# EAGLE design esp32programer (EAGLE 9.6.2)
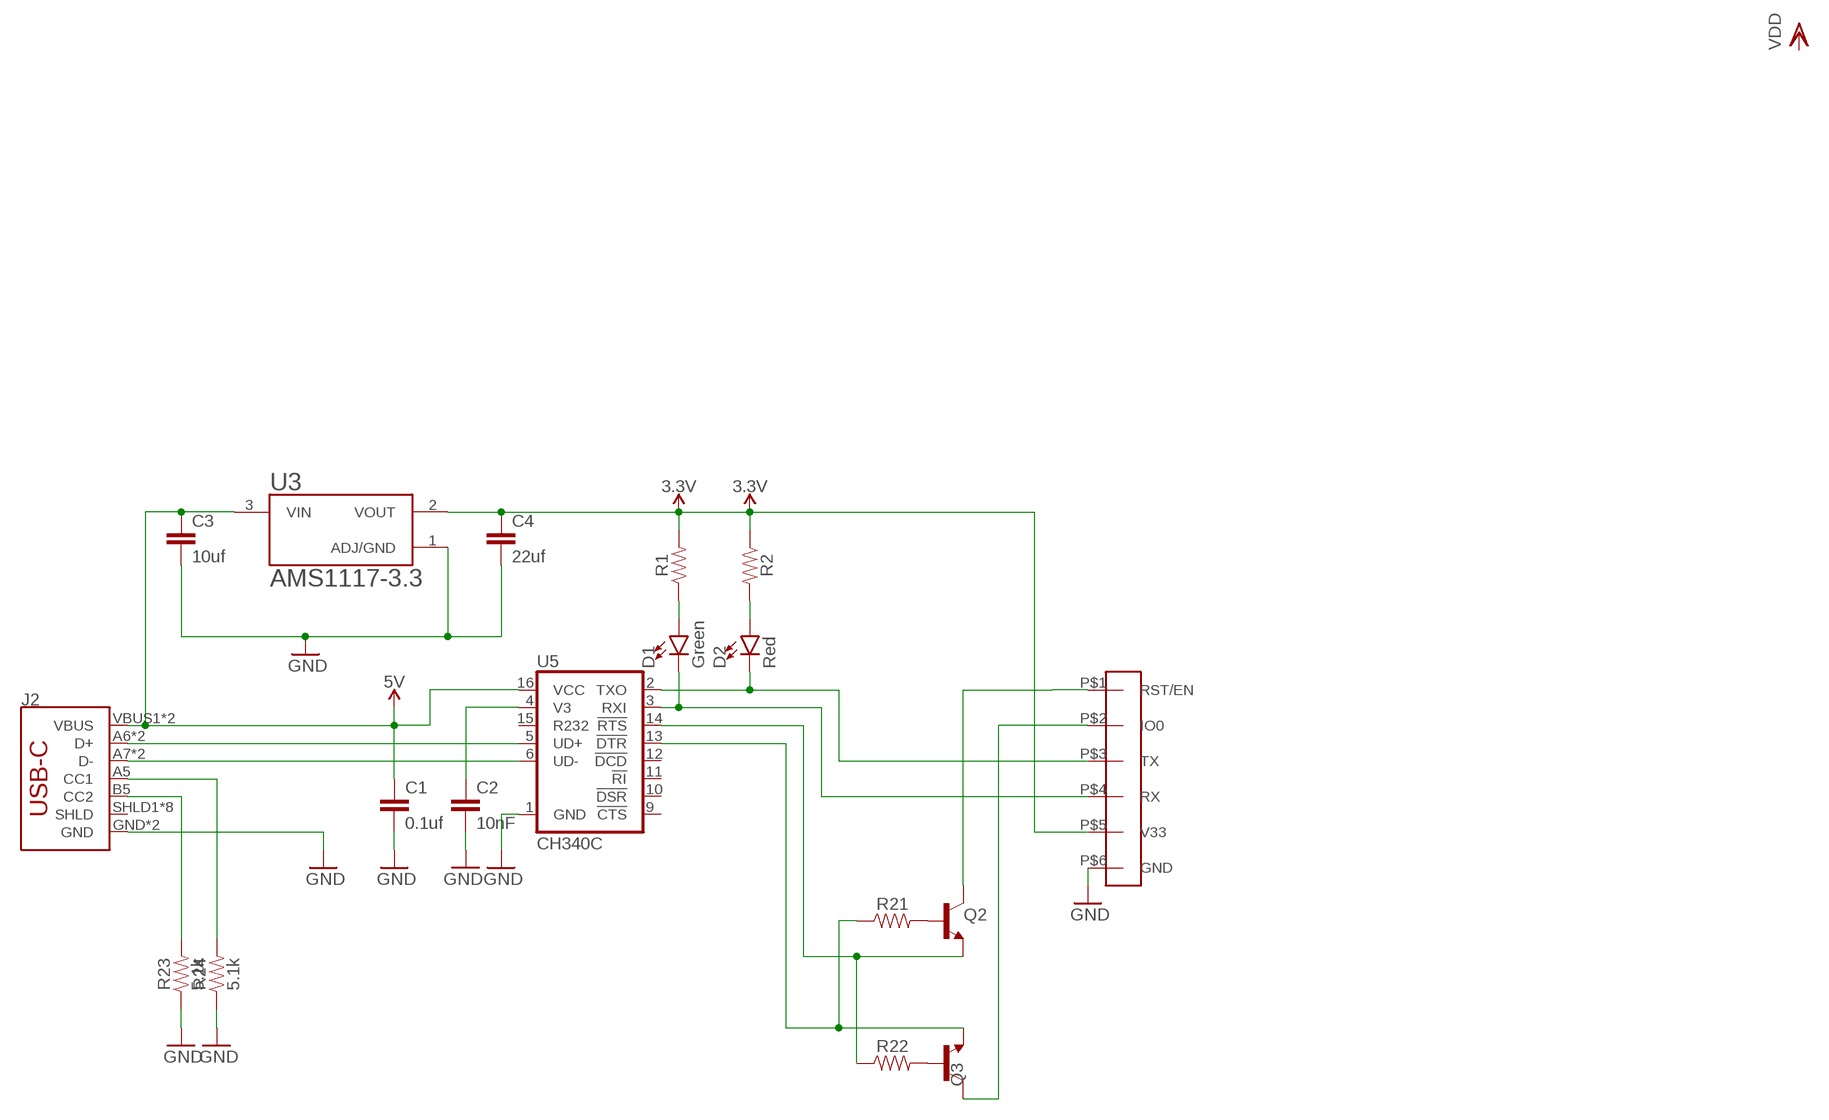
[diagram p0: schematic, sheet 1]

## Parts
C1  0.1uf  CAP-0805  [0805]
C2  10nF  CAP-0805  [0805]
C3  10uf  CAP-0805  [0805]
C4  22uf  CAP-0805  [0805]
D1  Green  LED-GREEN0805-PG  [LED-0805]
D2  Red  LED-RED-0805  [LED-0805]
J2  USB_C16PIN  [USB-C-16P]
Q2  TRANSISTOR_BJT_NPN-SOT-23-BEC  [SOT-23]
Q3  TRANSISTOR_BJT_NPN-SOT-23-BEC  [SOT-23]
R1  RESISTOR0805  [0805]
R2  RESISTOR0805  [0805]
R21  RESISTOR0805  [0805]
R22  RESISTOR0805  [0805]
R23  5.1k  RESISTOR0805  [0805]
R24  5.1k  RESISTOR0805  [0805]
U3  AMS1117-3.3  [SOT229P700X180-4N]
U5  CH340C  [SO016]
U$6  USBCOUT  [6PINS]

## Nets
3.3V [power]: C4.1 R1.2 R2.1 U3.2(VOUT) U$6.P$5(V33)
5V: C1.1 C3.1 J2.VBUS1(VBUS) J2.VBUS2(VBUS) U3.3(VIN) U5.16(VCC)
!DTR: Q3.2(E) R21.1 U5.13(!DTR)
CC2: J2.B5(CC2) R23.2
D+: J2.A6(D+) J2.B6(D+) U5.5(UD+)
D-: J2.A7(D-) J2.B7(D-) U5.6(UD-)
GND: C1.2 C2.2 C3.2 C4.2 J2.GND J2.GND2(GND) R23.1 R24.1 U3.1(ADJ/GND) U5.1(GND) U$6.P$6(GND)
N$1: D1.C U5.3(RXI) U$6.P$4(RX)
N$4: C2.1 U5.4(V3)
N$10: D1.A R1.1
N$11: D2.A R2.2
N$25: Q2.3(C) U$6.P$1(RST/EN)
N$30: Q3.3(C) U$6.P$2(IO0)
N$48: Q2.2(E) R22.1 U5.14(!RTS)
N$49: Q2.1(B) R21.2
N$50: Q3.1(B) R22.2
N$53: J2.A5(CC1) R24.2
RXI: D2.C U5.2(TXO) U$6.P$3(TX)
Unconnected: J2.SHLD1(SHLD) J2.SHLD2(SHLD) J2.SHLD3(SHLD) J2.SHLD4(SHLD) J2.SHLD5(SHLD) J2.SHLD6(SHLD) J2.SHLD7(SHLD) J2.SHLD8(SHLD) U5.9(!CTS) U5.10(!DSR) U5.11(!RI) U5.12(!DCD) U5.15(R232)

## Library data of the parts
C1-C4 = SparkFun-Capacitors:CAP
D1 = SparkFun-LED:LED-GREEN: Green SMD LED Used in manufacturing of various products at SparkFun Packages: 0603 - SMD 0603 package [Product Link] <http://www.futureelectronics.com/en/technologies/semiconductors/optoelectronics/leds/Pages/9894312-LTST-C190GKT.aspx?CrossPart=HSMG-C190&IM=0> LilyPad 1206 - SMD1206 LilyPad package [Product Link] <http://www.futureelectronics.com/en/Technologies/Product.aspx?ProductID=IN150NGHARVATEKCORPORATION2049943&IM=0> 1206 - SMD1206 package [Product Link] <http://www.futureelectronics.com/en/technologies/semiconductors/optoelectronics/leds/Pages/8315665-LTST-C150KGKT.aspx?IM=0> 1206 Bottom Mount -SMD 1206 Bottom Mount [Product Link] <http://www.digikey.com/product-detail/en/lite-on-inc/LTST-C230KGKT/160-1456-1-ND/386854> SparkFun Products: Pro Mini 328 -5V <https://www.sparkfun.com/products/821> RedBoard <https://www.sparkfun.com/products/12757> MP3 Trigger <https://www.sparkfun.com/products/13720> Makey Makey <https://www.sparkfun.com/products/11076>
D2 = SparkFun-LED:LED-RED: Red SMD LED Used in manufacturing of most products at SparkFun Packages: 0603 - KB - KingBright (DIO-17976) SMD 0603 package [Datasheet] <https://www.kingbrightusa.com/images/catalog/SPEC/APT1608SURCK.pdf> 0603 - (DIO-00819, has gone EOL) SMD 0603 package 0603 SMART - SMD 0603 SMART package ( more efficient and expensive)[Product Link] <http://www.osram-os.com/Graphics/XPic2/00077099_0.pdf> 1206 - SMD1206 package [Product Link] <https://www.sparkfun.com/datasheets/DevTools/LilyPad/Q150OVS4.pdff> SparkFun Products: Pro Mini 328 -5V <https://www.sparkfun.com/products/821> RedBoard <https://www.sparkfun.com/products/12757> IOIO-OTG <https://www.sparkfun.com/products/13613>; PROD_ID: DIO-16865
J2 = SparkFun-Connectors:USB_C: USB Type C 16Pin Connector Super Speed pins not available on the 16-pin purely SMD connector so this part is best for USB 2.0 implementations. D1 and D2 are tied together enabling D+/- no matter which way the cable is plugged into the connector. The two channel configuration pins (CC1/2) are exposed. These are normally connected to ground via 5.1k resistors but can be reconfigured for high current/high power applications.; PROD_ID: CONN-14122
Q2 Q3 = dp_devices:TRANSISTOR_BJT_NPN: Most commonly used is SOT23-BEC
R1 R2 R21-R24 = SparkFun-Resistors:RESISTOR: Generic Resistor Package
U3 = AMS1117-3.3:AMS1117-3.3: Sot223/Pkg 1-Amp 3.3-Volt Low Drop Out Voltage Regulatator; AVAILABILITY: Unavailable; DESCRIPTION: Sot223/Pkg 1-Amp 3.3-Volt Low Drop Out Voltage Regulatator; MF: Advanced Monolithic Systems; MP: AMS1117-3.3; PACKAGE: None; PRICE: None
U5 = SparkFun-IC-Comms:CH340C; PROD_ID: IC-14038
U$6 = MouseLib:USBCOUT

## Net classes
1 power: width 0.178 mm

## Board
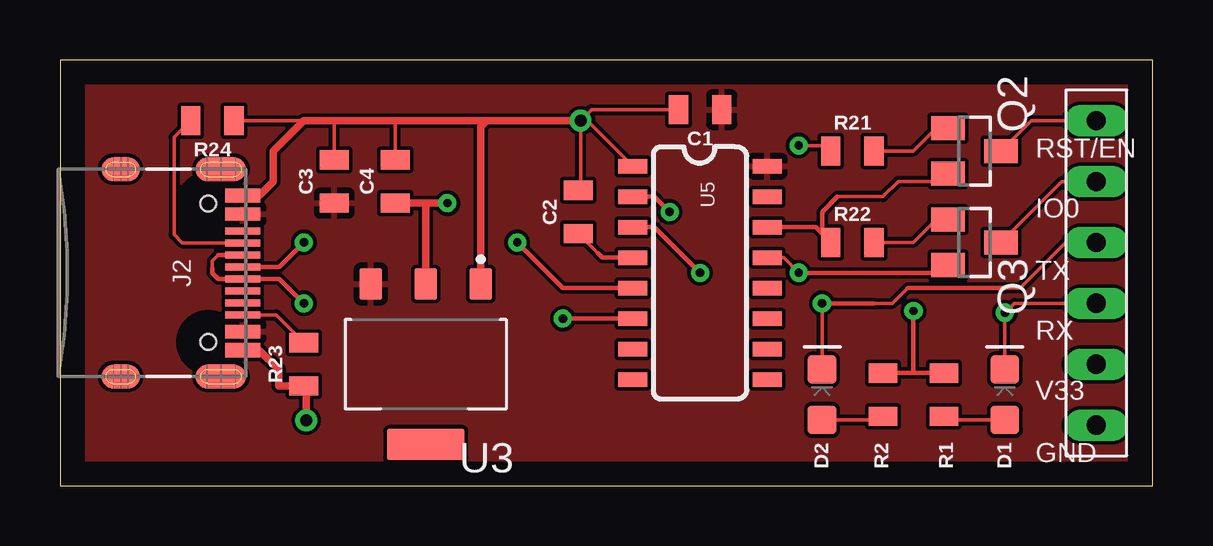
[diagram p1: board, top side]
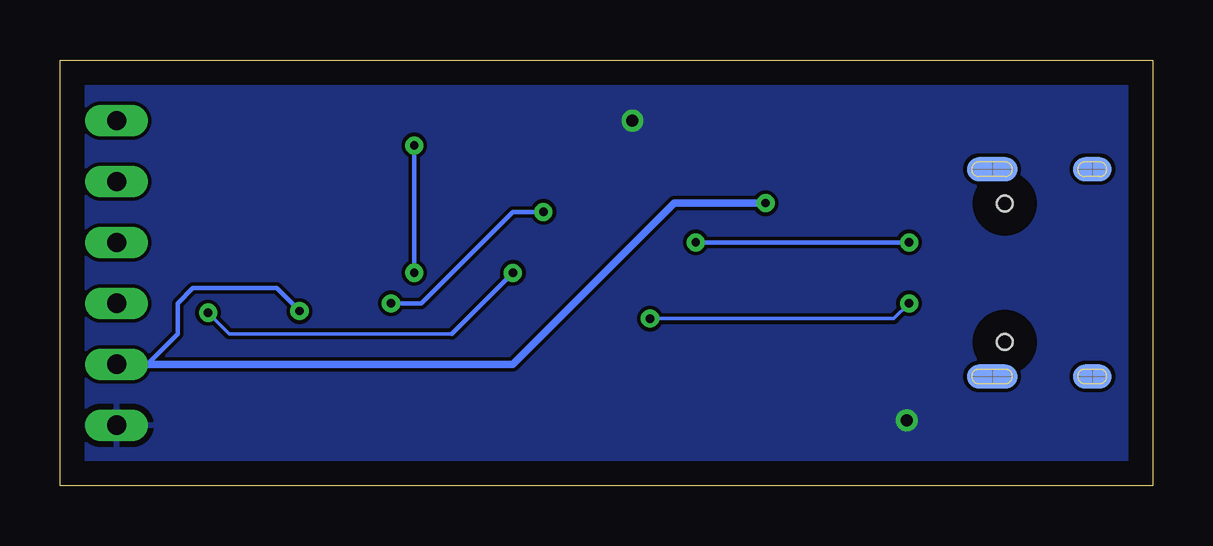
[diagram p2: board, bottom side, seen from below]

Size 45.54 x 17.77 mm. Coordinates in mm from the lower left corner, seen from the top.
Outline: 0,0 45.54,0 45.54,17.77 0,17.77 0,0
Copper layers (1*16): Top 0.035mm / dielectric 1.5mm / Bottom 0.035mm
Design rules "default": minimum track width 6mil, minimum drill 0.35mm, track to track 6mil, track to pad 6mil, pad to pad 6mil, via to via 6mil, smd to smd 6mil, copper to edge 40mil, drill to drill 6mil, minimum pad ring 10mil, minimum via ring 8mil, stop-mask expansion 4mil, vias tented up to drill 0mil, thermal gap 10mil

### Footprints (pad centres in the part's own frame; a part is rotated, then mirrored left to right if it is on the bottom)
0805 = smd 0.8 x 1.2: 1 -0.9,0; 2 0.9,0
LED-0805 = smd 1.2 x 1.2: A -1.05,0; C 1.05,0
USB-C-16P = smd 0.3 x 1.45: A5 -1.25,0; A6 -0.25,0; A7 0.25,0; A8 1.25,0; B5 1.75,0; B6 0.75,0; B7 -0.75,0; B8 -1.75,0 | smd 0.6 x 1.45: GND -3.225,0; GND2 3.225,0 | smd 1 x 2.1: SHLD1 -4.32,-0.915; SHLD2 4.32,-0.915 | smd 1 x 2.1 bottom: SHLD3 -4.32,-0.915; SHLD4 4.32,-0.915 | smd 1 x 1.6: SHLD5 -4.32,-5.095; SHLD8 4.32,-5.095 | smd 1 x 1.6 bottom: SHLD6 -4.32,-5.095; SHLD7 4.32,-5.095 | smd 0.55 x 1.45: VBUS1 -2.45,0; VBUS2 2.45,0 | hole 0.65: -2.89,-1.445; 2.89,-1.445
SOT-23 = smd 1 x 1.4: 1 -0.95,-1.1; 2 0.95,-1.1; 3 0,1.1
SOT229P700X180-4N = smd 0.93 x 1.31: 1 -2.29,-3.345; 2 0,-3.345; 3 2.29,-3.345 | smd 3.24 x 1.31: 4 0,3.345
SO016 = smd 0.6 x 1.2: 1 -4.445,-2.8; 2 -3.175,-2.8; 3 -1.905,-2.8; 4 -0.635,-2.8; 5 0.635,-2.8; 6 1.905,-2.8; 7 3.175,-2.8; 8 4.445,-2.8; 9 4.445,2.8; 10 3.175,2.8; 11 1.905,2.8; 12 0.635,2.8; 13 -0.635,2.8; 14 -1.905,2.8; 15 -3.175,2.8; 16 -4.445,2.8
6PINS = drill 0.8 pad 1.143 long: P$1 -2.54,10.16; P$2 -2.54,7.62; P$3 -2.54,5.08; P$4 -2.54,2.54; P$5 -2.54,0; P$6 -2.54,-2.54

### Placement (x,y rotation side)
C1  26.67,15.7 180 top
C2  21.59,11.43 90 top
C3  11.43,12.7 90 top
C4  13.97,12.7 90 top
D1  39.37,3.81 90 top
D2  31.75,3.81 90 top
J2  7.62,8.89 270 top
Q2  38.1,13.97 270 top
Q3  38.1,10.16 270 top
R1  36.83,3.81 90 top
R2  34.29,3.81 270 top
R21  33.02,13.97 0 top
R22  33.02,10.16 0 top
R23  10.16,5.08 90 top
R24  6.35,15.24 180 top
U3  15.24,5.08 180 top
U5  26.67,8.89 270 top
U$6  45.72,5.08 0 top

### Tracks (layer width: path | path; a pad name or v marks a point on that pad's centre or on a via)
3.3V  (via drill 0.35)
  Top 0.178: R2.1 35.56,4.71 | R1.2 35.56,4.71 | 35.56,4.71 v35.56,7.3
  Top 0.305: C4.1 15.24,11.8 | 15.24,11.8 v16.14,11.8 | U3.2 15.24,11.8
  Bottom 0.178: U$6.P$5 41.91,5.08 40.64,6.35 40.64,7.62 40.01,8.25 36.51,8.25 v35.56,7.3
  Bottom 0.305: U$6.P$5 26.67,5.08 19.95,11.8 v16.14,11.8
5V
  pour Top: -5.08,22.86 -5.08,-1.27 0,-6.35 52.07,-6.35 52.07,22.86
!DTR  (via drill 0.35)
  Top 0.152: U5.13 30.15,9.53 v30.78,8.89 | v30.78,14.2 31.89,14.2 R21.1
  Top 0.178: v30.78,8.89 36.68,8.89 Q3.2
  Bottom 0.178: v30.78,14.2 v30.78,8.89
CC2
  Top 0.152: J2.B5 9,7.14 R23.2
D+  (via drill 0.35)
  Top 0.178: v19.05,10.16 20.95,8.26 U5.5 | J2.A6 9.14,9.14 v10.16,10.16
  Bottom 0.178: v19.05,10.16 v10.16,10.16
D-  (via drill 0.35)
  Top 0.152: 6.6,9.64 6.35,9.39 6.35,9.09
  Top 0.178: J2.B7 6.6,9.64 | 6.35,9.09 6.35,8.89 6.6,8.64 J2.A7 9.14,8.64 v10.16,7.62 | v20.95,6.99 U5.6
  Bottom 0.152: v20.95,6.99 10.79,6.99 v10.16,7.62
GND  (via drill 0.5)
  Top 0.152: C2.2 21.69,12.43 21.69,15.14 21.59,15.24 21.96,15.24 U5.1 | R24.1 10.16,15.24 | C4.2 13.97,15.24 | C3.2 11.43,15.24 | v21.69,15.24 22.15,15.7 C1.2 | J2.GND 8.3,12.12
  Top 0.305: 8.3,12.12 8.89,12.7 8.89,13.97 10.16,15.24 11.43,15.24 13.97,15.24 17.78,15.24 | 17.78,15.24 21.59,15.24 v21.69,15.24 | 17.78,15.24 17.53,14.99 U3.1 | v10.26,2.74 10.26,4.08 R23.1 9.11,4.18 9.11,4.87 8.3,5.67 J2.GND2
  pour Bottom: -2.54,-1.27 0,-3.81 49.53,-3.81 49.53,20.16 -2.54,20.16
N$1  (via drill 0.35)
  Top 0.152: D1.C v39.37,7.23 39.76,7.62 U$6.P$4
  Top 0.178: U5.3 24.77,10.79 v26.67,8.89
  Bottom 0.152: 29.21,6.35 38.49,6.35 v39.37,7.23
  Bottom 0.178: v26.67,8.89 29.21,6.35
N$4
  Top 0.152: C2.1 22.41,9.71
  Top 0.178: 22.41,9.71 22.59,9.53 U5.4
N$10
  Top 0.152: R1.1 36.98,2.76 D1.A
N$11
  Top 0.152: D2.A 34.14,2.76 R2.2
N$25
  Top 0.152: Q2.3 40.47,15.24 U$6.P$1
N$30
  Top 0.152: Q3.3 41.74,12.7 U$6.P$2
N$48
  Top 0.152: 32.38,12.06 34.29,12.06 34.92,12.7 36.68,12.7 Q2.2
  Top 0.178: 32.38,12.06 31.75,11.43 31.75,10.53 | 31.75,10.53 R22.1 | U5.14 31.48,10.79 31.75,10.53
N$49
  Top 0.152: R21.2 35.56,13.97 36.51,14.92 Q2.1
N$50
  Top 0.152: R22.2 35.56,10.16 36.51,11.11 Q3.1
N$53
  Top 0.152: R24.2 4.76,14.55 4.76,10.48 5.1,10.14 J2.A5
RXI  (via drill 0.35)
  Top 0.152: U$6.P$3 41.91,10.16 40.01,8.26 39.37,8.26 | D2.C v31.75,7.62 | 33.9,7.62 34.68,7.62 35.32,8.26
  Top 0.178: U5.2 24.77,12.06 v25.4,11.43 | 35.32,8.26 39.37,8.26 | v31.75,7.62 33.9,7.62
  Bottom 0.178: v25.4,11.43 26.67,11.43 30.48,7.62 v31.75,7.62

### Text on the board
tPlace: RST/EN | IO0 | TX | RX | V33 | GND